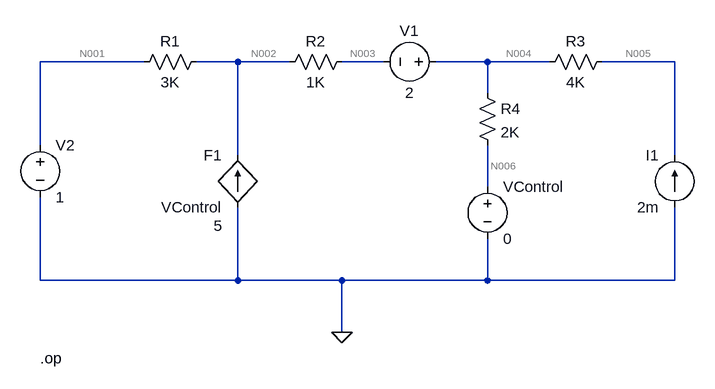
[diagram p0: schematic electronica.asc]
electronica.asc, the LTspice schematic file:
Version 4
SHEET 1 932 680
WIRE 80 -96 -80 -96
WIRE 224 -96 160 -96
WIRE 304 -96 224 -96
WIRE 448 -96 384 -96
WIRE 608 -96 528 -96
WIRE 704 -96 608 -96
WIRE 896 -96 784 -96
WIRE 608 -48 608 -96
WIRE -80 32 -80 -96
WIRE 224 48 224 -96
WIRE 896 48 896 -96
WIRE 608 96 608 32
WIRE -80 240 -80 112
WIRE 224 240 224 128
WIRE 224 240 -80 240
WIRE 384 240 224 240
WIRE 608 240 608 176
WIRE 608 240 384 240
WIRE 896 240 896 128
WIRE 896 240 608 240
WIRE 384 320 384 240
FLAG 384 320 0
DATAFLAG 0 -96 ""
SYMBOL res 176 -112 R90
WINDOW 0 0 56 VBottom 2
WINDOW 3 32 56 VTop 2
SYMATTR InstName R1
SYMATTR Value 3K
SYMBOL res 400 -112 R90
WINDOW 0 0 56 VBottom 2
WINDOW 3 32 56 VTop 2
SYMATTR InstName R2
SYMATTR Value 1K
SYMBOL res 800 -112 R90
WINDOW 0 0 56 VBottom 2
WINDOW 3 32 56 VTop 2
SYMATTR InstName R3
SYMATTR Value 4K
SYMBOL res 592 -64 R0
SYMATTR InstName R4
SYMATTR Value 2K
SYMBOL current 896 128 R180
WINDOW 0 24 80 Left 2
WINDOW 3 24 0 Left 2
WINDOW 123 0 0 Left 0
WINDOW 39 0 0 Left 0
SYMATTR InstName I1
SYMATTR Value 2m
SYMBOL voltage 544 -96 R90
WINDOW 0 -32 56 VBottom 2
WINDOW 3 32 56 VTop 2
WINDOW 123 0 0 Left 0
WINDOW 39 0 0 Left 0
SYMATTR InstName V1
SYMATTR Value 2
SYMBOL voltage -80 16 R0
WINDOW 123 0 0 Left 0
WINDOW 39 0 0 Left 0
SYMATTR InstName V2
SYMATTR Value 1
SYMBOL f 224 128 R180
WINDOW 0 24 80 Left 2
WINDOW 3 24 0 Left 2
WINDOW 123 24 -28 Left 2
SYMATTR InstName F1
SYMATTR Value VControl
SYMATTR Value2 5
SYMBOL voltage 608 80 R0
WINDOW 123 0 0 Left 0
WINDOW 39 0 0 Left 0
SYMATTR InstName VControl
SYMATTR Value 0
TEXT -80 360 Left 2 !.op

The netlist it stands for:
* electronica.asc
R1 N002 N001 3K
R2 N003 N002 1K
R3 N005 N004 4K
R4 N004 N006 2K
I1 0 N005 2m
V1 N004 N003 2
V2 N001 0 1
F1 0 N002 VControl 5
VControl N006 0 0
.op
.backanno
.end

* Results of the author's LTspice run, read from the files saved beside the schematic
* Operating Point:
*   V(n002) = -7.667 V
*   V(n001) = 1 V
*   V(n003) = -4.444 V
*   V(n005) = 5.556 V
*   V(n004) = -2.444 V
*   V(n006) = 0 V
*   I(F1) = -6.111 mA
*   I(I1) = 2 mA
*   I(R4) = -1.222 mA
*   I(R3) = 2 mA
*   I(R2) = 3.222 mA
*   I(R1) = -2.889 mA
*   I(Vcontrol) = -1.222 mA
*   I(V2) = -2.889 mA
*   I(V1) = 3.222 mA